# Altium schematic sheet Misc.SchDoc
size A4
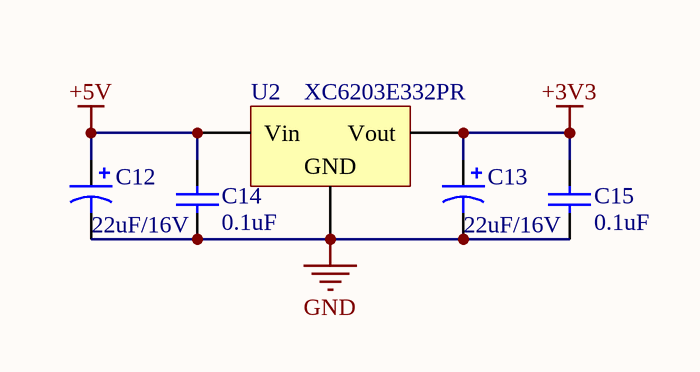
[diagram p0: Misc.SchDoc]

## Parts
C12  22uF/16V  [C2x3]
C13  22uF/16V  [C2x3]
C14  0.1uF  [C0805]
C15  0.1uF  [C0805]
U2  XC6203E332PR  [SOT89N]

## Nets
+3V3: C13.1 C15.2 U2.3(Vout)
+5V: C12.1 C14.2 U2.2(Vin)
GND: C12.2 C13.2 C14.1 C15.1 U2.1(GND)

## Library data of the parts
C12 C13 = Cap Pol1: 贴片钽电容
C14 C15 = Cap: 0805贴片电容
U2 = XC6203: 3.3V 400mA LDO